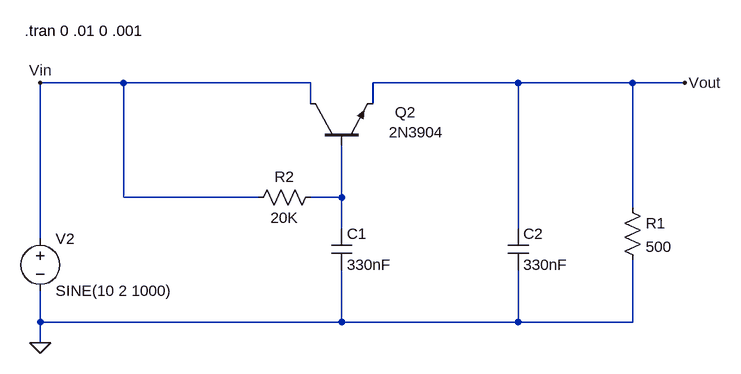
[diagram p0: schematic cap_mult2.asc]
cap_mult2.asc, the LTspice schematic file:
Version 4
SHEET 1 1784 1940
WIRE 272 656 144 656
WIRE 560 656 272 656
WIRE 880 656 656 656
WIRE 1056 656 880 656
WIRE 1136 656 1056 656
WIRE 560 688 560 656
WIRE 656 688 656 656
WIRE 272 832 272 656
WIRE 480 832 272 832
WIRE 608 832 608 752
WIRE 608 832 560 832
WIRE 1056 848 1056 656
WIRE 608 880 608 832
WIRE 880 880 880 656
WIRE 144 896 144 656
WIRE 144 1024 144 976
WIRE 608 1024 608 944
WIRE 608 1024 144 1024
WIRE 880 1024 880 944
WIRE 880 1024 608 1024
WIRE 1056 1024 1056 928
WIRE 1056 1024 880 1024
WIRE 144 1056 144 1024
FLAG 144 656 Vin
FLAG 1136 656 Vout
FLAG 144 1056 0
SYMBOL voltage 144 880 R0
WINDOW 123 0 0 Left 0
WINDOW 39 0 0 Left 0
SYMATTR InstName V2
SYMATTR Value SINE(10 2 1000)
SYMBOL npn 560 752 R270
WINDOW 0 51 130 VRight 2
WINDOW 3 20 121 VRight 2
SYMATTR InstName Q2
SYMATTR Value 2N3904
SYMBOL cap 592 880 R0
SYMATTR InstName C1
SYMATTR Value 330nF
SYMBOL cap 864 880 R0
SYMATTR InstName C2
SYMATTR Value 330nF
SYMBOL res 1040 832 R0
SYMATTR InstName R1
SYMATTR Value 500
SYMBOL res 576 816 R90
WINDOW 0 0 56 VBottom 2
WINDOW 3 32 56 VTop 2
SYMATTR InstName R2
SYMATTR Value 20K
TEXT 120 576 Left 2 !.tran 0 .01 0 .001

The netlist it stands for:
* cap_mult2.asc
V2 Vin 0 SINE(10 2 1000)
Q2 Vin N001 Vout 0 2N3904
C1 N001 0 330nF
C2 Vout 0 330nF
R1 Vout 0 500
R2 N001 Vin 20K
.model NPN NPN
.model PNP PNP
.lib standard.bjt
.tran 0 .01 0 .001
.backanno
.end